# Altium schematic sheet ESQUEMATICO SENSOR RPM.SchDoc
size Tabloid; SheetNumber: 1; SheetTotal: 1
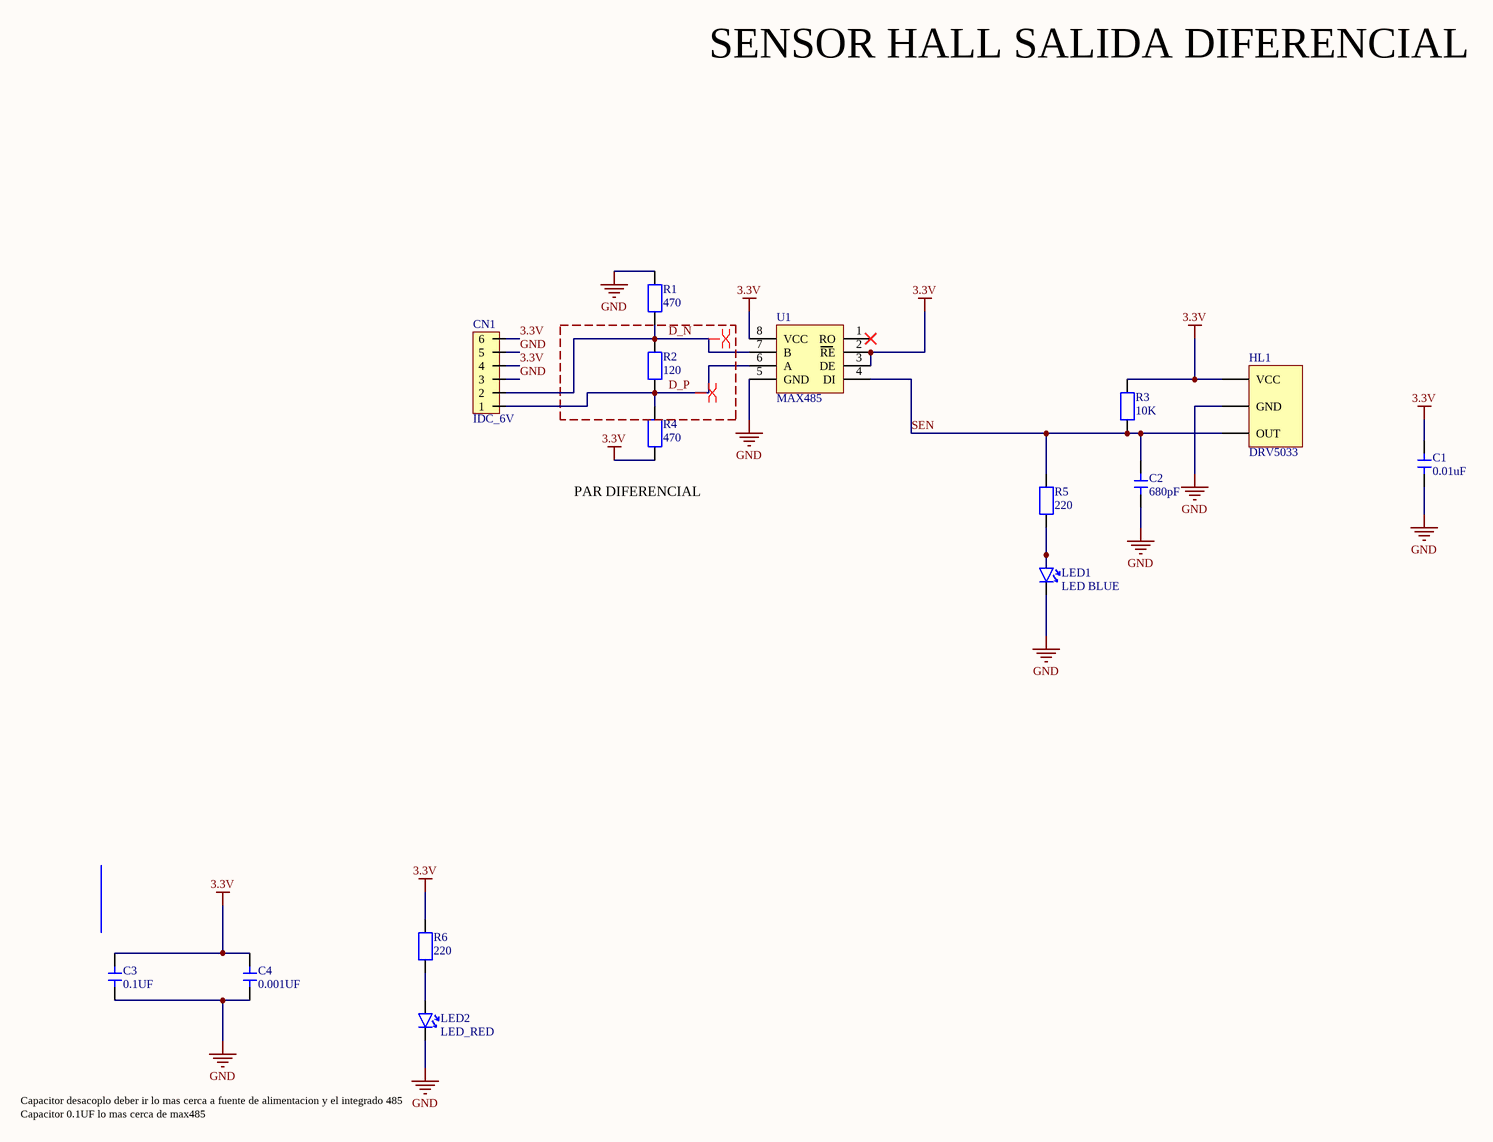
[diagram p0: ESQUEMATICO SENSOR RPM.SchDoc]

## Parts
C1  0.01uF  [C0805]
C2  680pF  [C0805]
C3  0.1UF  [C0805]
C4  0.001UF  [C0805]
CN1  IDC_6V  [IDC_MALE_6V]
HL1  DRV5033  [DRV5033]
LED1  LED BLUE  [LED0805]
LED2  LED_RED  [LED0805]
R1  470  [R0805]
R2  120  [R0805]
R3  10K  [R0805]
R4  470  [R0805]
R5  220  [R0805]
R6  220  [R0805]
U1  MAX485  [IC485]

## Nets
3.3V: C1.2 C3.2 C4.2 CN1.4 CN1.6 HL1.1(VCC) R3.2 R4.1 R6.2 U1.2(RE) U1.3(DE) U1.8(VCC)
GND: C1.1 C2.1 C3.1 C4.1 CN1.3 CN1.5 HL1.2(GND) LED1.2(C) LED2.2(C) R1.2 U1.5(GND)
D_N: CN1.2 R1.1 R2.2 U1.7(B)
D_P: CN1.1 R2.1 R4.2 U1.6(A)
SEN: C2.2 HL1.3(OUT) R3.1 R5.2 U1.4(DI)
NetLED1_1: LED1.1(A) R5.1
NetLED2_1: LED2.1(A) R6.1

Not connected (* = marked no-connect by the designer): U1 1(RO)*

## Layout directives
differential pair: D_N, D_P

## Notes on the sheet
- SENSOR HALL SALIDA DIFERENCIAL
- (near R4) PAR DIFERENCIAL
- Capacitor desacoplo deber ir lo mas cerca a fuente de alimentacion y el integrado 485
- Capacitor 0.1UF lo mas cerca de max485

## Library data of the parts
C1-C4 = CAP0805
CN1 = IDC_MALE_6V
LED1 LED2 = LED0805: LED 0805
R1-R6 = R0805
U1 = IC485